# EAGLE schematic BuckConvertor (EAGLE 9.6.2)
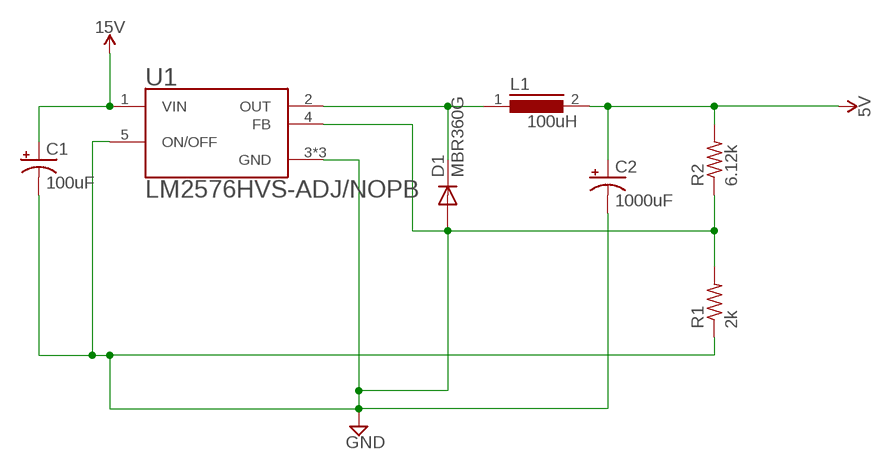
[diagram p0: schematic, sheet 1]

## Parts
C1  100uF  1000UF-RADIAL-5MM-25V-20%  [CPOL-RADIAL-5MM-10MM]
C2  1000uF  1000UF-RADIAL-5MM-25V-20%  [CPOL-RADIAL-5MM-10MM]
D1  MBR360G  [DIOB_MBR360G]
L1  100uH  DR73  [DR73]
R1  2k  R-US_0204/5  [0204/5]
R2  6.12k  R-US_0204/5  [0204/5]
U1  LM2576HVS-ADJ/NOPB  [REG_LM2576HVS-ADJ/NOPB]

## Nets
GND: C1.- C2.- D1.A R1.1 R1.2 R2.1 U1.3(GND) U1.4(FB) U1.5(ON/OFF) U1.6(GND) U1.7(GND)
N$2: D1.C L1.1 U1.2(OUT)
VIN: C1.+ U1.1(VIN) ; supply symbol labelled 15V
VOUT: C2.+ L1.2 R2.2 ; supply symbol labelled 5V

## Library data of the parts
C1 C2 = SparkFun-Capacitors:1000UF: 1,000µF/1mF ceramic capacitors A capacitor is a passive two-terminal electrical component used to store electrical energy temporarily in an electric field. CAP-08070; PROD_ID: CAP-09538; VALUE: 1mF
D1 = MBR360G:MBR360G: MBR360 Series 3 A 60 V Axial Lead Schottky Rectifier; AVAILABILITY: Unavailable; DESCRIPTION: Diode Schottky 60V 3A Through Hole DO-201AD; DIGIKEY-PURCHASE-URL: https://snapeda.com/shop?store=DigiKey&id=53063; MF: ON Semiconductor; MP: MBR360G; PACKAGE: DO-201 ON Semiconductor; PRICE: None
L1 = inductors:DR73: High Power Density, High Efficiency, Shielded Inductors Source: coiltronics_dr_series.pdf; SPICEPREFIX: L
R1 R2 = rcl:R-US_: RESISTOR, American symbol; SPICEPREFIX: R
U1 = LM2576HVS-ADJ_NOPB:LM2576HVS-ADJ/NOPB: IC REG BUCK ADJ 3A DDPAK; AVAILABILITY: Unavailable; DESCRIPTION: Buck Switching Regulator IC Positive Adjustable 1.23V 1 Output 3A TO-263-6, D²Pak (5 Leads + Tab), TO-263BA; DIGIKEY-PURCHASE-URL: https://snapeda.com/shop?store=DigiKey&id=213619; MF: Texas Instruments; MP: LM2576HVS-ADJ/NOPB; PACKAGE: TO-263-5 Texas Instruments; PRICE: None